# EAGLE schematic boost-demux_v1 (EAGLE 8.3.1)
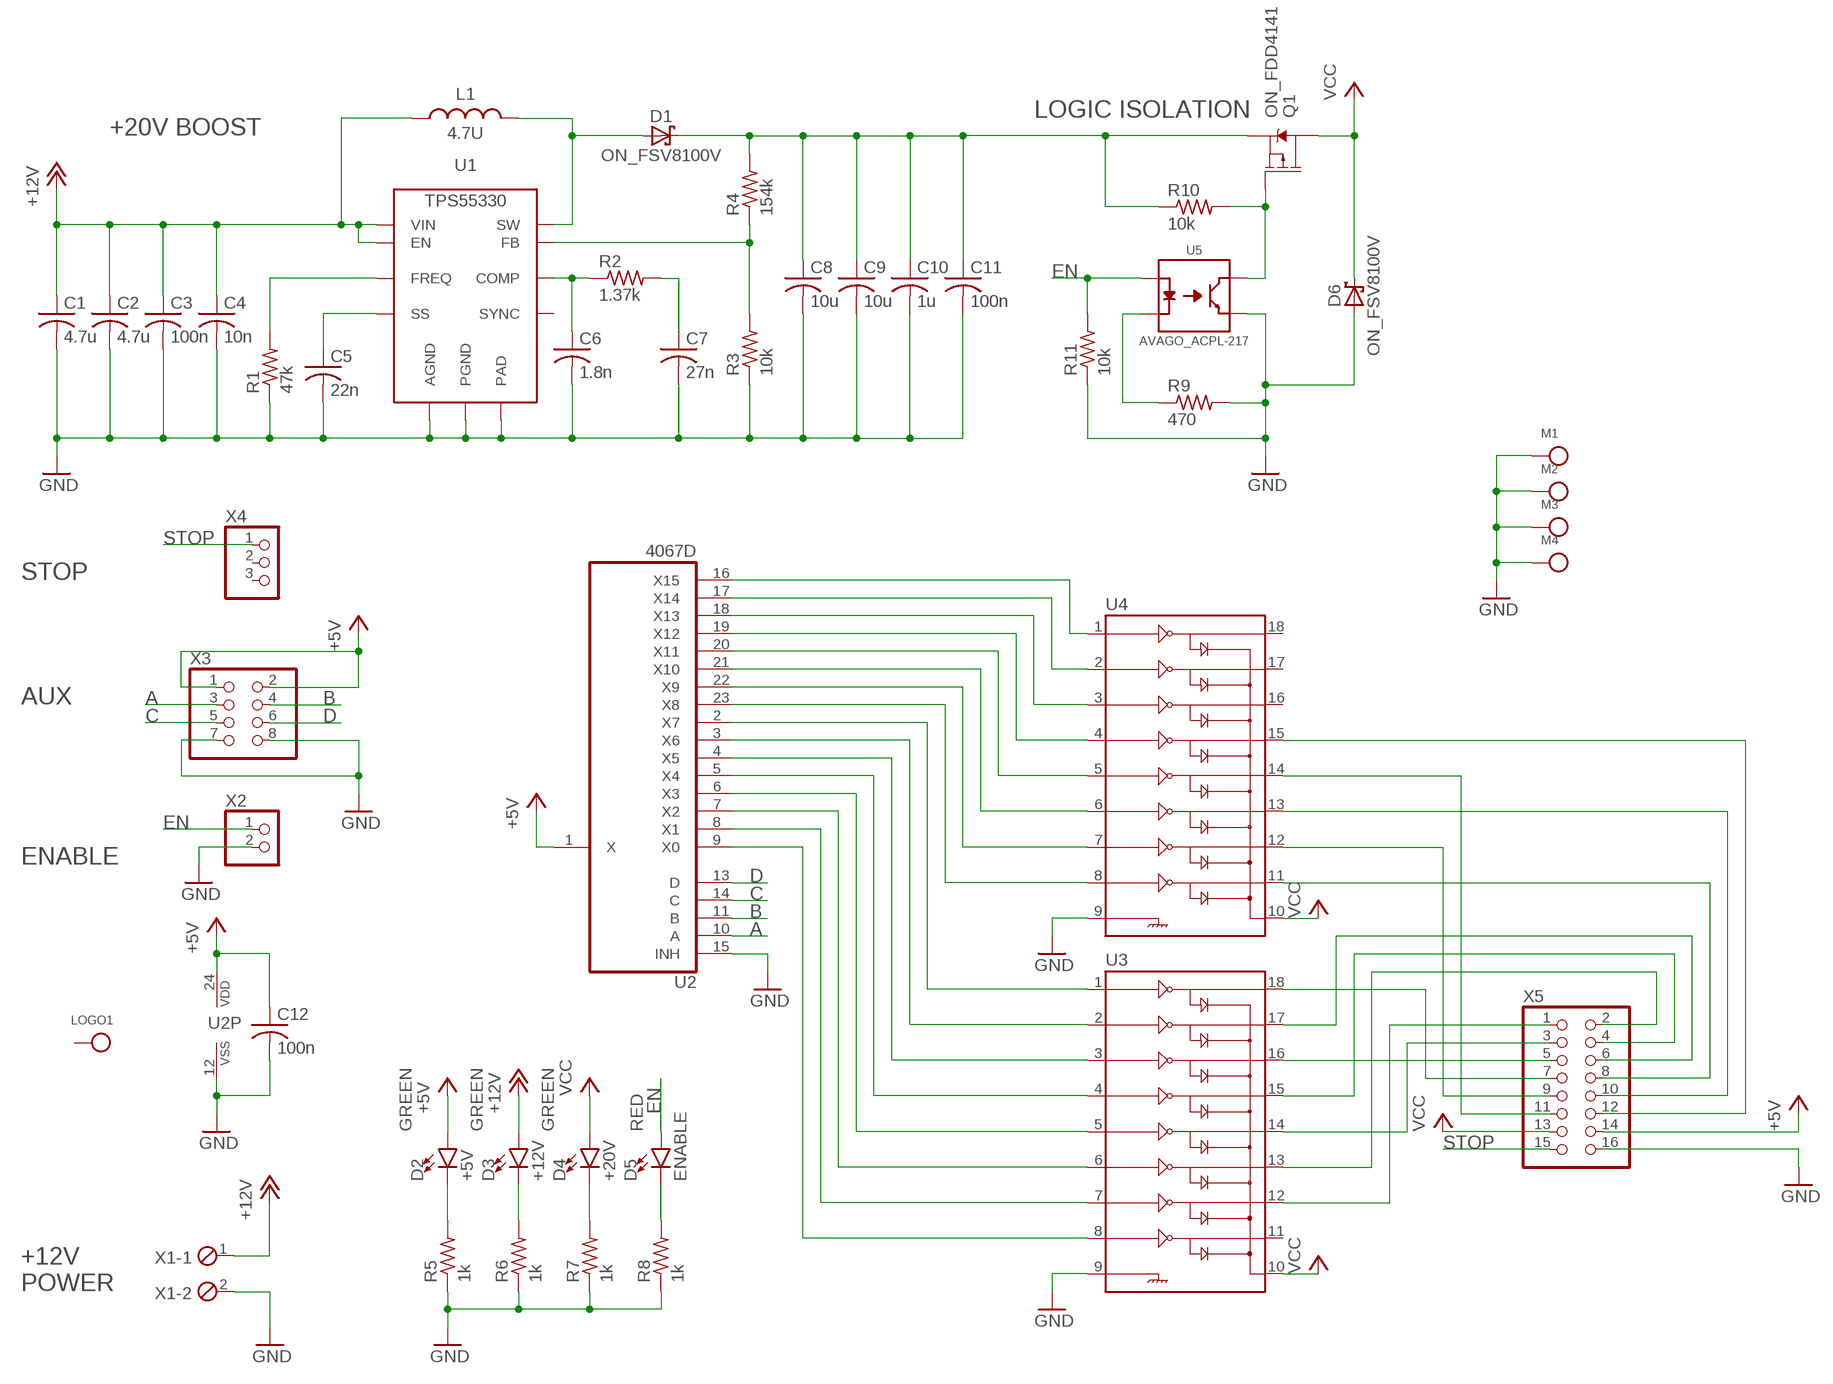
[diagram p0: schematic, sheet 1]

## Parts
C1  4.7u  C-USC1206  [C1206]
C2  4.7u  C-USC1206  [C1206]
C3  100n  C-USC1206  [C1206]
C4  10n  C-USC1206  [C1206]
C5  22n  C-USC1206  [C1206]
C6  1.8n  C-USC0805  [C0805]
C7  27n  C-USC0805  [C0805]
C8  10u  C-USC1206  [C1206]
C9  10u  C-USC1206  [C1206]
C10  1u  C-USC1206  [C1206]
C11  100n  C-USC1206  [C1206]
C12  100n  C-USC1206  [C1206]
D1  ON_FSV8100V  [TO-277-3]
D2  +5V  LED5MM  [LED_5MM]
D3  +12V  LED5MM  [LED_5MM]
D4  +20V  LED5MM  [LED_5MM]
D5  ENABLE  LED5MM  [LED_5MM]
D6  ON_FSV8100V  [TO-277-3]
L1  4.7U  MURATA_FDVE1040  [4440]
LOGO1  MADOG  [MADOG]
M1  6-32_MOUNT  [6-32_MOUNT]
M2  6-32_MOUNT  [6-32_MOUNT]
M3  6-32_MOUNT  [6-32_MOUNT]
M4  6-32_MOUNT  [6-32_MOUNT]
Q1  ON_FDD4141  [TO-252-3]
R1  47k  R-US_R1206  [R1206]
R2  1.37k  R-US_R0805  [R0805]
R3  10k  R-US_R0805  [R0805]
R4  154k  R-US_R0805  [R0805]
R5  1k  R-US_R1206  [R1206]
R6  1k  R-US_R1206  [R1206]
R7  1k  R-US_R1206  [R1206]
R8  1k  R-US_R1206  [R1206]
R9  470  R-US_R1206  [R1206]
R10  10k  R-US_R0805  [R0805]
R11  10k  R-US_R0805  [R0805]
U1  TI_TPS55330  [S-PWQFN-N16]
U2  4067D  [SO24W]
U3  ULN2803SOICW  [SO18L]
U4  ULN2803SOICW  [SO18L]
U5  AVAGO_ACPL-217  [SOIC-4]
X1  MPT2  [2POL254]
X2  PINHD-1X2/90  [1X02/90]
X3  PINHD-2X4/90  [2X04/90]
X4  PINHD-1X3/90  [1X03/90]
X5  PINHD-2X8  [2X08]

## Nets
+5V: C12.1 D2.A U2.1(X) U2.24(VDD) X3.1 X3.2 X5.14
+12V: C1.1 C2.1 C3.1 C4.1 D3.A L1.1 U1.2(VIN) U1.3(EN) X1.1
A: U2.10(A) X3.3
B: U2.11(B) X3.4
C: U2.14(C) X3.5
D: U2.13(D) X3.6
EN: D5.A R11.2 U5.P$1 X2.1
GND: C1.2 C2.2 C3.2 C4.2 C5.2 C6.2 C7.2 C8.2 C9.2 C10.2 C11.2 C12.2 D6.P$1(A) D6.P$2(A) M1.P$1 M1.P$2 M1.P$3 M1.P$4 M1.P$5 M1.P$6 M1.P$7 M1.P$8 M1.P$9 M2.P$1 M2.P$2 M2.P$3 M2.P$4 M2.P$5 M2.P$6 M2.P$7 M2.P$8 M2.P$9 M3.P$1 M3.P$2 M3.P$3 M3.P$4 M3.P$5 M3.P$6 M3.P$7 M3.P$8 M3.P$9 M4.P$1 M4.P$2 M4.P$3 M4.P$4 M4.P$5 M4.P$6 M4.P$7 M4.P$8 M4.P$9 R1.1 R3.1 R5.1 R6.1 R7.1 R8.1 R9.2 R11.1 U1.6(AGND) U1.11(PGND) U1.12(PGND) U1.13(PGND) U1.PAD U2.12(VSS) U2.15(INH) U3.9 U4.9 U5.P$3 X1.2 X2.2 X3.7 X3.8 X5.16
N$1: R1.2 U1.9(FREQ)
N$2: C5.1 U1.4(SS)
N$3: C6.1 R2.1 U1.7(COMP)
N$4: C7.1 R2.2
N$5: R3.2 R4.1 U1.8(FB)
N$6: D2.K(C) R5.2
N$7: D1.P$1(A) D1.P$2(A) L1.2 U1.1(SW) U1.15(SW) U1.16(SW)
N$8: D3.K(C) R6.2
N$9: D4.K(C) R7.2
N$10: D5.K(C) R8.2
N$11: U2.9(X0) U3.8
N$12: C8.1 C9.1 C10.1 C11.1 D1.P$3(C) Q1.P$3(S) R4.2 R10.1
N$13: Q1.P$1(G) R10.2 U5.P$4
N$14: U3.12 X5.1
N$15: U2.8(X1) U3.7
N$16: U2.7(X2) U3.6
N$17: U2.6(X3) U3.5
N$18: U3.13 X5.2
N$19: R9.1 U5.P$2
N$20: U2.5(X4) U3.4
N$21: U2.4(X5) U3.3
N$22: U2.3(X6) U3.2
N$23: U2.2(X7) U3.1
N$24: U2.23(X8) U4.8
N$25: U2.22(X9) U4.7
N$26: U2.21(X10) U4.6
N$27: U2.20(X11) U4.5
N$28: U2.19(X12) U4.4
N$29: U2.18(X13) U4.3
N$30: U2.17(X14) U4.2
N$31: U2.16(X15) U4.1
N$32: U3.14 X5.3
N$33: U3.15 X5.4
N$34: U3.16 X5.5
N$35: U3.17 X5.6
N$36: U3.18 X5.7
N$37: U4.11 X5.8
N$38: U4.12 X5.9
N$39: U4.13 X5.10
N$40: U4.14 X5.11
N$41: U4.15 X5.12
STOP: X4.1 X5.15
VCC: D4.A D6.P$3(C) Q1.P$4(D) U3.10 U4.10 X5.13
Unconnected: LOGO1.P$1 U1.5(SYNC) U3.11 U4.16 U4.17 U4.18 X4.2 X4.3

## Notes on the sheet
- LOGIC ISOLATION
- +20V BOOST
- STOP
- AUX
- ENABLE
- GREEN | GREEN | GREEN | RED
- +12V
  POWER

## Library data of the parts
C1-C12 = rcl:C-US: CAPACITOR, American symbol
D1 D6 = components:ON_FSV8100V
D2-D5 = SparkFun-LED:LED: LED (Generic) Standard schematic elements and footprints for 5mm, 3mm, 1206, and 0603 sized LEDs. Generic LEDs with no color specified.
L1 = components:MURATA_FDVE1040
LOGO1 = components:MADOG
M1-M4 = components:6-32_MOUNT
Q1 = components:ON_FDD4141
R1-R4 R10 R11 = rcl:R-US_: RESISTOR, American symbol
R5-R9 = resistor:R-US_: RESISTOR, American symbol
U1 = components:TI_TPS55330
U2 = 40xx:4067: 16-channel ANALOG MULTIPLEXER
U3 U4 = SparkFun-PowerIC:ULN2803: Darlington Driver ULN2803 Darlington array. 500mA max per channel, 8-channel package. Spark Fun Electronics SKU : COM-00312
U5 = components:AVAGO_ACPL-217
X1 = con-phoenix-254:MPT2: PHOENIX CONNECTOR; OC_FARNELL: unknown; OC_NEWARK: unknown
X2 = pinhead:PINHD-1X2: PIN HEADER
X3 = pinhead:PINHD-2X4: PIN HEADER
X4 = pinhead:PINHD-1X3: PIN HEADER
X5 = pinhead:PINHD-2X8: PIN HEADER